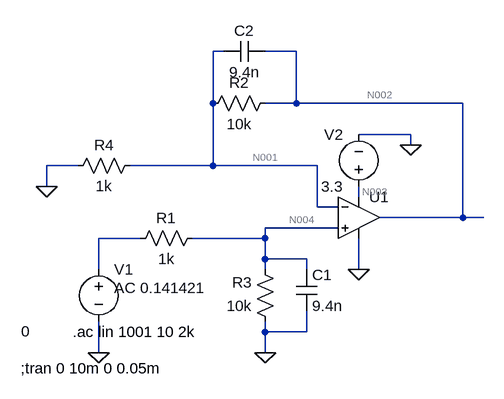
[diagram p0: schematic q2analoguelab2.asc]
q2analoguelab2.asc, the LTspice schematic file:
Version 4
SHEET 1 880 680
WIRE 272 -208 256 -208
WIRE 384 -208 336 -208
WIRE 256 -128 256 -208
WIRE 384 -128 384 -208
WIRE 384 -128 336 -128
WIRE 640 -128 384 -128
WIRE 560 -80 480 -80
WIRE 560 -64 560 -80
WIRE 48 -32 0 -32
WIRE 256 -32 256 -128
WIRE 256 -32 128 -32
WIRE 416 -32 256 -32
WIRE 0 0 0 -32
WIRE 480 16 480 0
WIRE 416 32 416 -32
WIRE 448 32 416 32
WIRE 640 48 640 -128
WIRE 640 48 512 48
WIRE 672 48 640 48
WIRE 448 64 336 64
WIRE 144 80 80 80
WIRE 336 80 336 64
WIRE 336 80 224 80
WIRE 336 112 336 80
WIRE 400 112 336 112
WIRE 80 128 80 80
WIRE 336 128 336 112
WIRE 400 128 400 112
WIRE 480 128 480 80
WIRE 336 224 336 208
WIRE 400 224 400 192
WIRE 400 224 336 224
WIRE 80 256 80 208
WIRE 336 256 336 224
FLAG 0 0 0
FLAG 480 128 0
FLAG 336 256 0
FLAG 80 256 0
FLAG 560 -64 0
SYMBOL voltage 80 112 R0
WINDOW 3 -119 111 Left 2
WINDOW 123 24 44 Left 2
WINDOW 39 0 0 Left 2
SYMATTR Value 0
SYMATTR Value2 AC 0.141421
SYMATTR InstName V1
SYMBOL res 240 64 R90
WINDOW 0 0 56 VBottom 2
WINDOW 3 32 56 VTop 2
SYMATTR InstName R1
SYMATTR Value 1k
SYMBOL res 352 -144 R90
WINDOW 0 0 56 VBottom 2
WINDOW 3 32 56 VTop 2
SYMATTR InstName R2
SYMATTR Value 10k
SYMBOL res 352 224 R180
WINDOW 0 36 76 Left 2
WINDOW 3 36 40 Left 2
SYMATTR InstName R3
SYMATTR Value 10k
SYMBOL res 144 -48 R90
WINDOW 0 0 56 VBottom 2
WINDOW 3 32 56 VTop 2
SYMATTR InstName R4
SYMATTR Value 1k
SYMBOL Opamps\\UniversalOpamp2 480 48 R0
SYMATTR InstName U1
SYMBOL voltage 480 16 R180
WINDOW 0 24 96 Left 2
WINDOW 3 24 16 Left 2
SYMATTR InstName V2
SYMATTR Value 3.3
SYMBOL cap 384 128 R0
SYMATTR InstName C1
SYMATTR Value 9.4n
SYMBOL cap 336 -224 R90
WINDOW 0 0 32 VBottom 2
WINDOW 3 32 32 VTop 2
SYMATTR InstName C2
SYMATTR Value 9.4n
TEXT -40 280 Left 2 !;tran 0 10m 0 0.05m
TEXT 40 224 Left 2 !.ac lin 1001 10 2k

The netlist it stands for:
* q2analoguelab2.asc
V1 N005 0 0 AC 0.141421
R1 N004 N005 1k
R2 N002 N001 10k
R3 0 N004 10k
R4 N001 0 1k
XU1 N004 N001 N003 0 N002 level.2 Avol=1Meg GBW=10Meg Slew=10Meg ilimit=25m rail=0 Vos=0 phimargin=45 en=0 enk=0 in=0 ink=0 Rin=500Meg  ; pins IN+ IN- V+ V- OUT
V2 N003 0 3.3
C1 N004 0 9.4n
C2 N002 N001 9.4n
;tran 0 10m 0 0.05m
.ac lin 1001 10 2k
.lib UniversalOpamps2.sub
.backanno
.end

* Results of the author's LTspice run, read from the files saved beside the schematic
* Operating Point, zero values left out:
*   V(n004) = 3 µV
*   V(n002) = 17.33 mV
*   V(n001) = 1.578 mV
*   V(n003) = 3.3 V
*   I(R4) = 1.578 µA
*   I(R3) = -300 pA
*   I(R2) = 1.575 µA
*   I(R1) = 3 nA
*   I(V2) = -24.68 µA
*   I(V1) = 3 nA
*   Ix(u1:1) = -3.3 nA
*   Ix(u1:2) = -3.297 nA
*   Ix(u1:3) = 24.68 µA
*   Ix(u1:4) = -23.08 µA
*   Ix(u1:5) = -1.575 µA
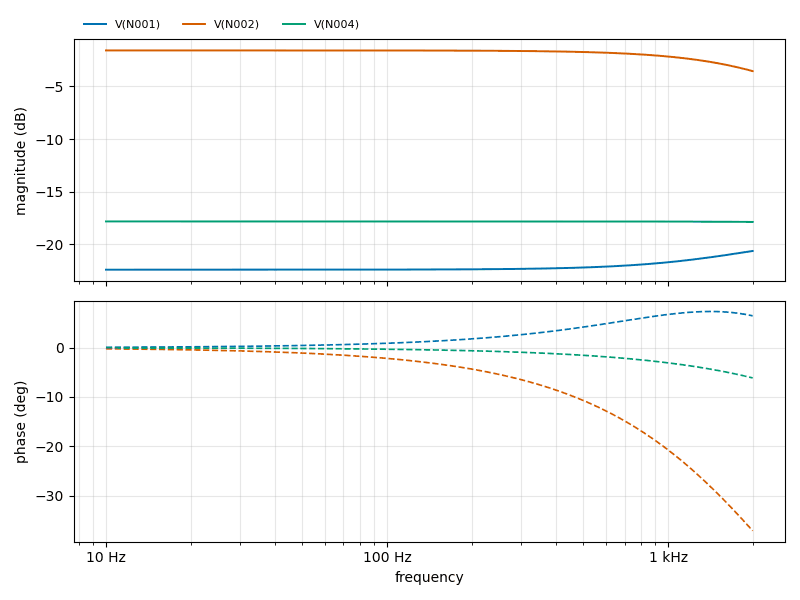
[diagram p1: AC Analysis of q2analoguelab2.asc, plotted from the saved traces]
* AC Analysis, 1 run:
*   V(N001): -22.40 dB at 10 Hz, -20.62 dB at 2 kHz, peak -20.62 dB at 2 kHz
*   V(N002): -1.57 dB at 10 Hz, -3.54 dB at 2 kHz, peak -1.57 dB at 10 Hz
*   V(N004): -17.82 dB at 10 Hz, -17.87 dB at 2 kHz, peak -17.82 dB at 10 Hz